# EAGLE design RFMxx-LPC812 (EAGLE 7.1.0)
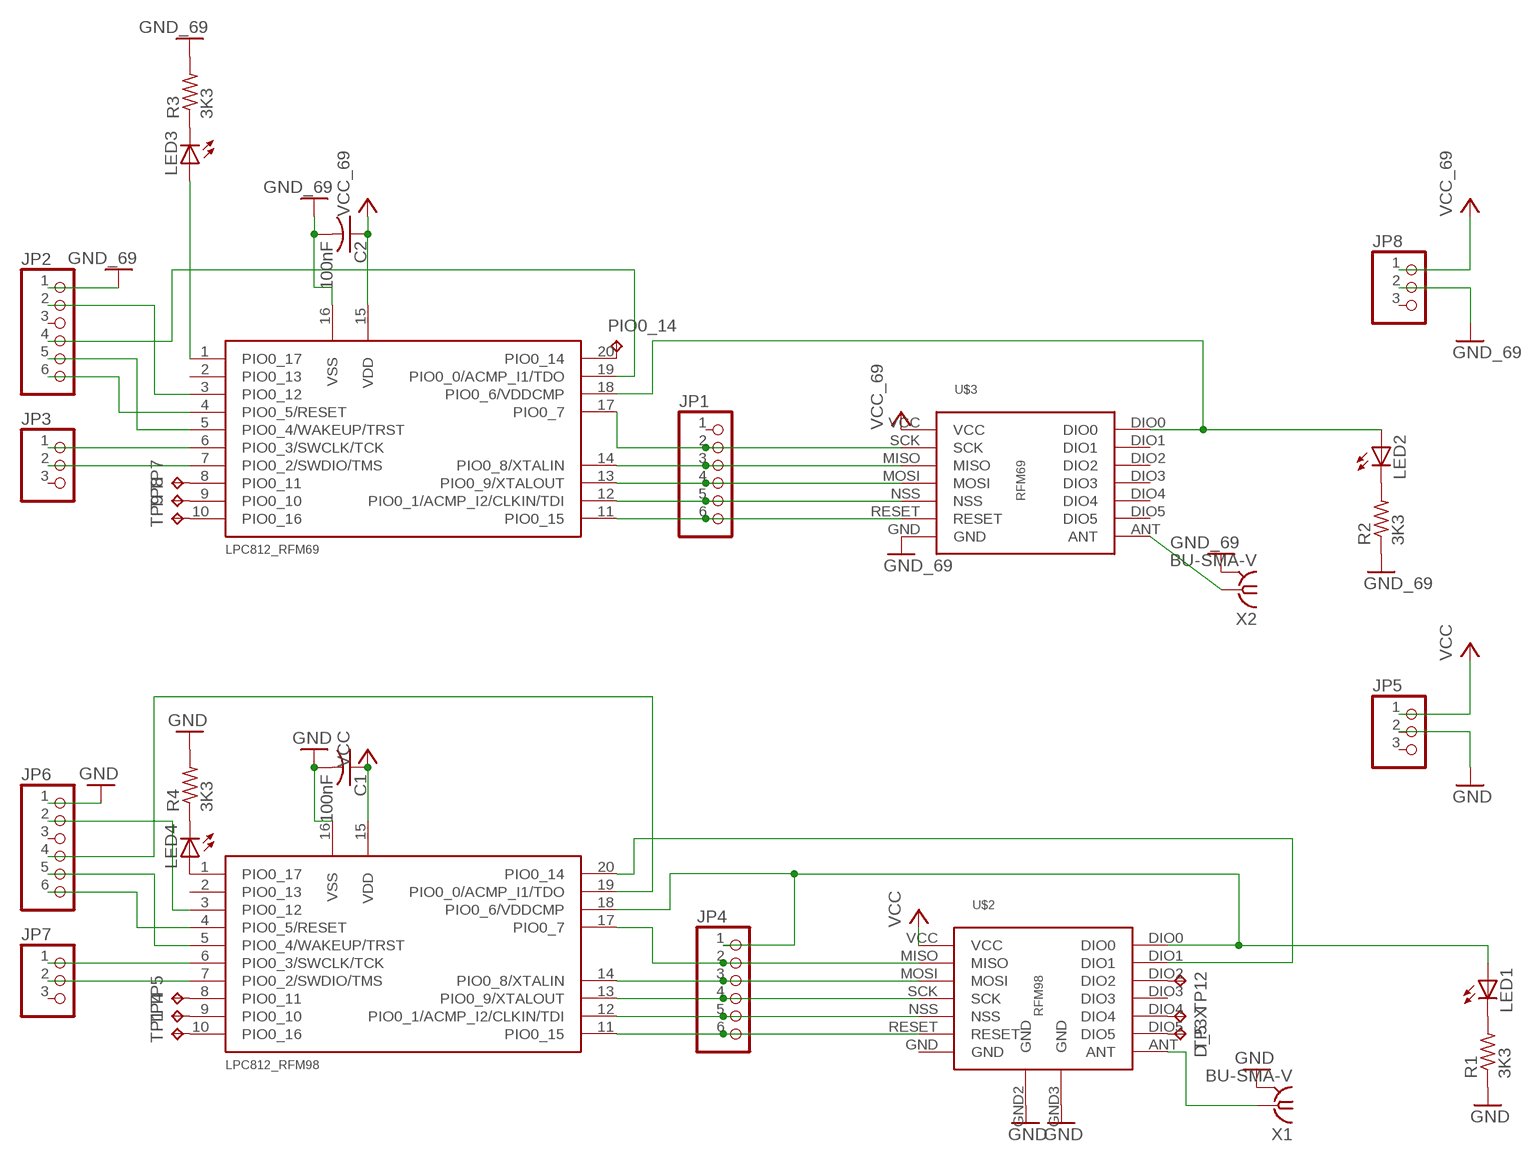
[diagram p0: schematic, sheet 1]

## Parts
C1  100nF  C-USC0805  [C0805]
C2  100nF  C-USC0805  [C0805]
D_5  TPB1,27  [B1,27]
JP1  PINHD-1X6  [1X06]
JP2  PINHD-1X6  [1X06]
JP3  PINHD-1X3  [1X03]
JP4  PINHD-1X6  [1X06]
JP5  PINHD-1X3  [1X03]
JP6  PINHD-1X6  [1X06]
JP7  PINHD-1X3  [1X03]
JP8  PINHD-1X3  [1X03]
LED1  LEDCHIP-LED0805  [CHIP-LED0805]
LED2  LEDCHIP-LED0805  [CHIP-LED0805]
LED3  LEDCHIP-LED0805  [CHIP-LED0805]
LED4  LEDCHIP-LED0805  [CHIP-LED0805]
LPC812_RFM69  LPC812M101JD20  [SOIC20]
LPC812_RFM98  LPC812M101JD20  [SOIC20]
PIO0_14  TPB1,27  [B1,27]
R1  3K3  R-US_R0805  [R0805]
R2  3K3  R-US_R0805  [R0805]
R3  3K3  R-US_R0805  [R0805]
R4  3K3  R-US_R0805  [R0805]
TP1  TPB1,27  [B1,27]
TP3X  TPB1,27  [B1,27]
TP4  TPB1,27  [B1,27]
TP5  TPB1,27  [B1,27]
TP7  TPB1,27  [B1,27]
TP8  TPB1,27  [B1,27]
TP9  TPB1,27  [B1,27]
TP12  TPB1,27  [B1,27]
U$2  RFM98W  [RFM98_PADS]
U$3  RFM69HW  [RFM69_PADS]
X1  BU-SMA-V  [BU-SMA-V]
X2  BU-SMA-V  [BU-SMA-V]

## Nets
GND: C1.2 C2.2 JP2.1 JP5.2 JP6.1 JP8.2 LPC812_RFM69.16(VSS) LPC812_RFM98.16(VSS) R1.1 R2.1 R3.2 R4.2 U$2.GND2(GND) U$2.GND3(GND) U$3.GND X1.2 X1.3 X1.4 X1.5 X2.2 X2.3 X2.4 X2.5 ; supply symbol labelled GND_69
N$1: U$3.ANT X2.1
N$2: JP2.5 LPC812_RFM69.5(PIO0_4/WAKEUP/TRST)
N$3: JP3.1 LPC812_RFM69.6(PIO0_3/SWCLK/TCK)
N$4: JP2.2 LPC812_RFM69.3(PIO0_12)
N$5: JP2.6 LPC812_RFM69.4(PIO0_5/RESET)
N$6: U$2.ANT X1.1
N$8: JP4.5 LPC812_RFM98.12(PIO0_1/ACMP_I2/CLKIN/TDI) U$2.NSS
N$9: JP4.3 LPC812_RFM98.14(PIO0_8/XTALIN) U$2.MOSI
N$10: JP4.4 LPC812_RFM98.13(PIO0_9/XTALOUT) U$2.SCK
N$11: JP4.2 LPC812_RFM98.17(PIO0_7) U$2.MISO
N$12: JP4.6 LPC812_RFM98.11(PIO0_15) U$2.RESET
N$13: JP1.6 LPC812_RFM69.11(PIO0_15) U$3.RESET
N$14: JP1.5 LPC812_RFM69.12(PIO0_1/ACMP_I2/CLKIN/TDI) U$3.NSS
N$15: JP1.4 LPC812_RFM69.13(PIO0_9/XTALOUT) U$3.MOSI
N$16: JP1.3 LPC812_RFM69.14(PIO0_8/XTALIN) U$3.MISO
N$17: JP6.6 LPC812_RFM98.4(PIO0_5/RESET)
N$18: JP6.5 LPC812_RFM98.5(PIO0_4/WAKEUP/TRST)
N$19: JP1.2 LPC812_RFM69.17(PIO0_7) U$3.SCK
N$20: JP6.4 LPC812_RFM98.19(PIO0_0/ACMP_I1/TDO)
N$21: JP6.2 LPC812_RFM98.3(PIO0_12)
N$22: JP4.1 LED1.A LPC812_RFM98.18(PIO0_6/VDDCMP) U$2.DIO0
N$23: JP3.2 LPC812_RFM69.7(PIO0_2/SWDIO/TMS)
N$24: LED2.A LPC812_RFM69.18(PIO0_6/VDDCMP) U$3.DIO0
N$25: LPC812_RFM98.10(PIO0_16) TP1.TP
N$26: LED4.A LPC812_RFM98.1(PIO0_17)
N$27: LPC812_RFM98.20(PIO0_14) U$2.DIO1
N$28: JP7.1 LPC812_RFM98.6(PIO0_3/SWCLK/TCK)
N$29: JP7.2 LPC812_RFM98.7(PIO0_2/SWDIO/TMS)
N$31: TP3X.TP U$2.DIO4
N$32: LPC812_RFM98.9(PIO0_10) TP4.TP
N$33: LPC812_RFM98.8(PIO0_11) TP5.TP
N$34: D_5.TP U$2.DIO5
N$35: JP2.4 LPC812_RFM69.19(PIO0_0/ACMP_I1/TDO)
N$36: LED3.A LPC812_RFM69.1(PIO0_17)
N$37: LED1.C R1.2
N$38: LED2.C R2.2
N$39: LED3.C R3.1
N$41: LPC812_RFM69.8(PIO0_11) TP7.TP
N$42: LED4.C R4.1
N$43: LPC812_RFM69.9(PIO0_10) TP8.TP
N$44: LPC812_RFM69.10(PIO0_16) TP9.TP
N$46: LPC812_RFM69.20(PIO0_14) PIO0_14.TP
N$52: TP12.TP U$2.DIO2
VCC: C1.1 C2.1 JP5.1 JP8.1 LPC812_RFM69.15(VDD) LPC812_RFM98.15(VDD) U$2.VCC U$3.VCC ; supply symbol labelled VCC_69
Unconnected: JP1.1 JP2.3 JP3.3 JP5.3 JP6.3 JP7.3 JP8.3 LPC812_RFM69.2(PIO0_13) LPC812_RFM98.2(PIO0_13) U$2.DIO3 U$2.GND U$3.DIO1 U$3.DIO2 U$3.DIO3 U$3.DIO4 U$3.DIO5

## Library data of the parts
C1 C2 = adafruit:C-US: CAPACITOR, American symbol
D_5 PIO0_14 TP1 TP3X TP4 TP5 TP7-TP9 TP12 = testpad:TP: Test pad
JP1 JP2 JP4 JP6 = adafruit:PINHD-1X6: PIN HEADER
JP3 JP5 JP7 JP8 = adafruit:PINHD-1X3: PIN HEADER
LED1-LED4 = adafruit:LED: LED OSRAM: - CHIPLED LG R971, LG N971, LY N971, LG Q971, LY Q971, LO R971, LY R971 LH N974, LH R974 LS Q976, LO Q976, LY Q976 LO Q996 - Hyper CHIPLED LW Q18S LB Q993, LB Q99A, LB R99A - SideLED LS A670, LO A670, LY A670, LG A670, LP A670 LB A673, LV A673, LT A673, LW A673 LH A674 LY A675 LS A676, LA A676, LO A676, LY A676, LW A676 LS A679, LY A679, LG A679 - Hyper Micro SIDELED® LS Y876, LA Y876, LO Y876, LY Y876 LT Y87S - SmartLED LW L88C, LW L88S LB L89C, LB L89S, LG L890 LS L89K, LO L89K, LY L89K LS L896, LA L896, LO L896, LY L896 - TOPLED LS T670, LO T670, LY T670, LG T670, LP T670 LSG T670, LSP T670, LSY T670, LOP T670, LYG T670 LG T671, LOG T671, LSG T671 LB T673, LV T673, LT T673, LW T673 LH T674 LS T676, LA T676, LO T676, LY T676, LB T676, LH T676, LSB T676, LW T676 LB T67C, LV T67C, LT T67C, LS T67K, LO T67K, LY T67K, LW E67C LS E67B, LA E67B, LO E67B, LY E67B, LB E67C, LV E67C, LT E67C LW T67C LS T679, LY T679, LG T679 LS T770, LO T770, LY T770, LG T770, LP T770 LB T773, LV T773, LT T773, LW T773 LH T774 LS E675, LA E675, LY E675, LS T675 LS T776, LA T776, LO T776, LY T776, LB T776 LHGB T686 LT T68C, LB T68C - Hyper Mini TOPLED® LB M676 - Mini TOPLED Santana® LG M470 LS M47K, LO M47K, LY M47K Source: http://www.osram.convergy.de/
LPC812_RFM69 LPC812_RFM98 = LPC812:LPC812M101JD20
R1-R4 = resistor:R-US_: RESISTOR, American symbol
U$2 = hoperf-rfmxx:RFM98W
U$3 = hoperf-rfmxx:RFM69HW
X1 X2 = con-coax:BU-SMA-V: FEMALE SMA CONNECTOR Radiall distributor RS 112-3794; OC_FARNELL: unknown; OC_NEWARK: unknown

## Board
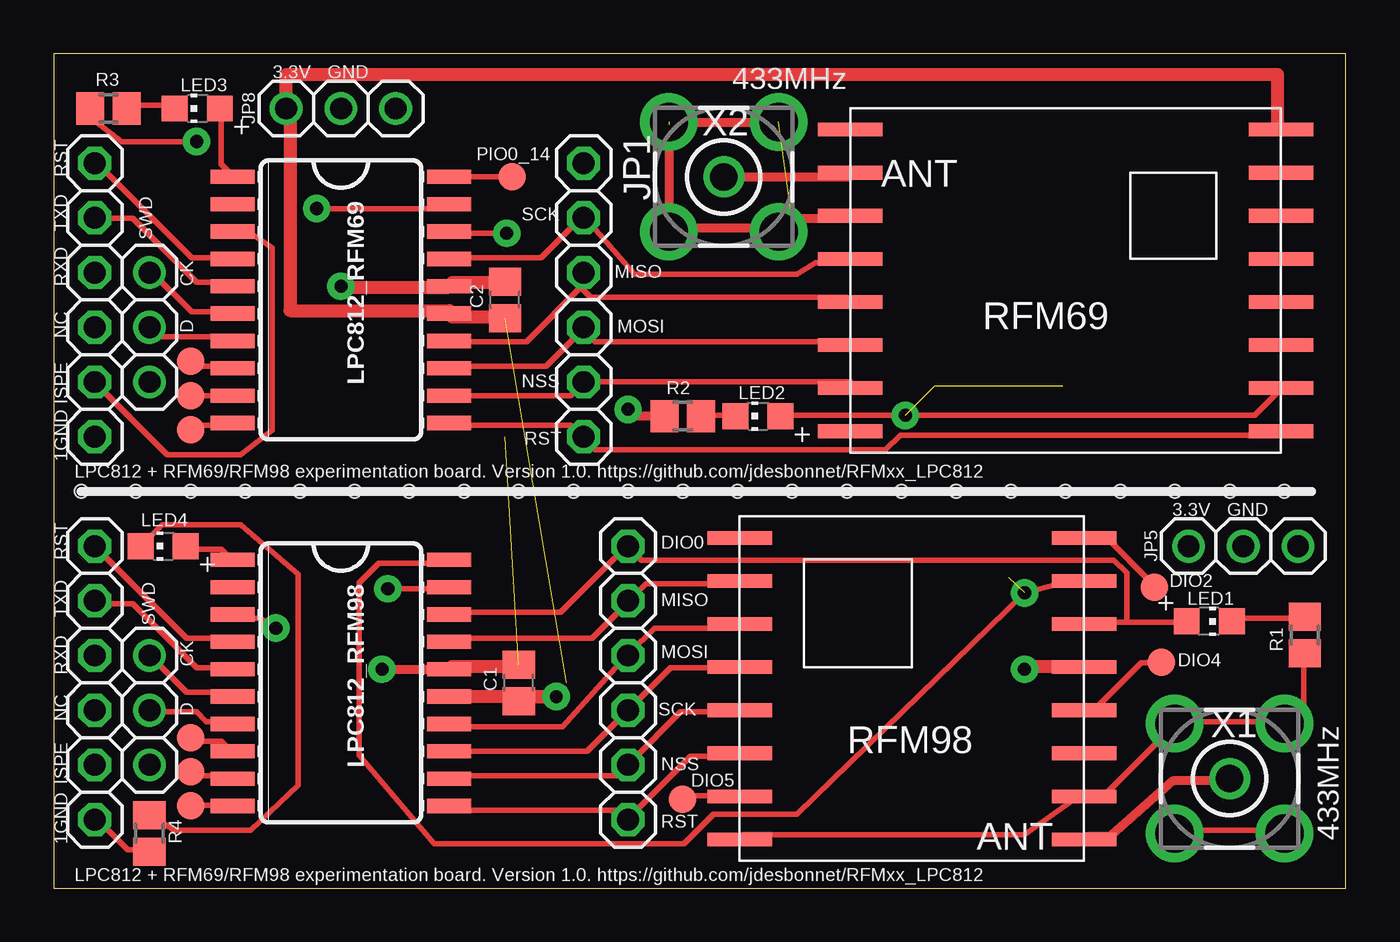
[diagram p1: board, top side]
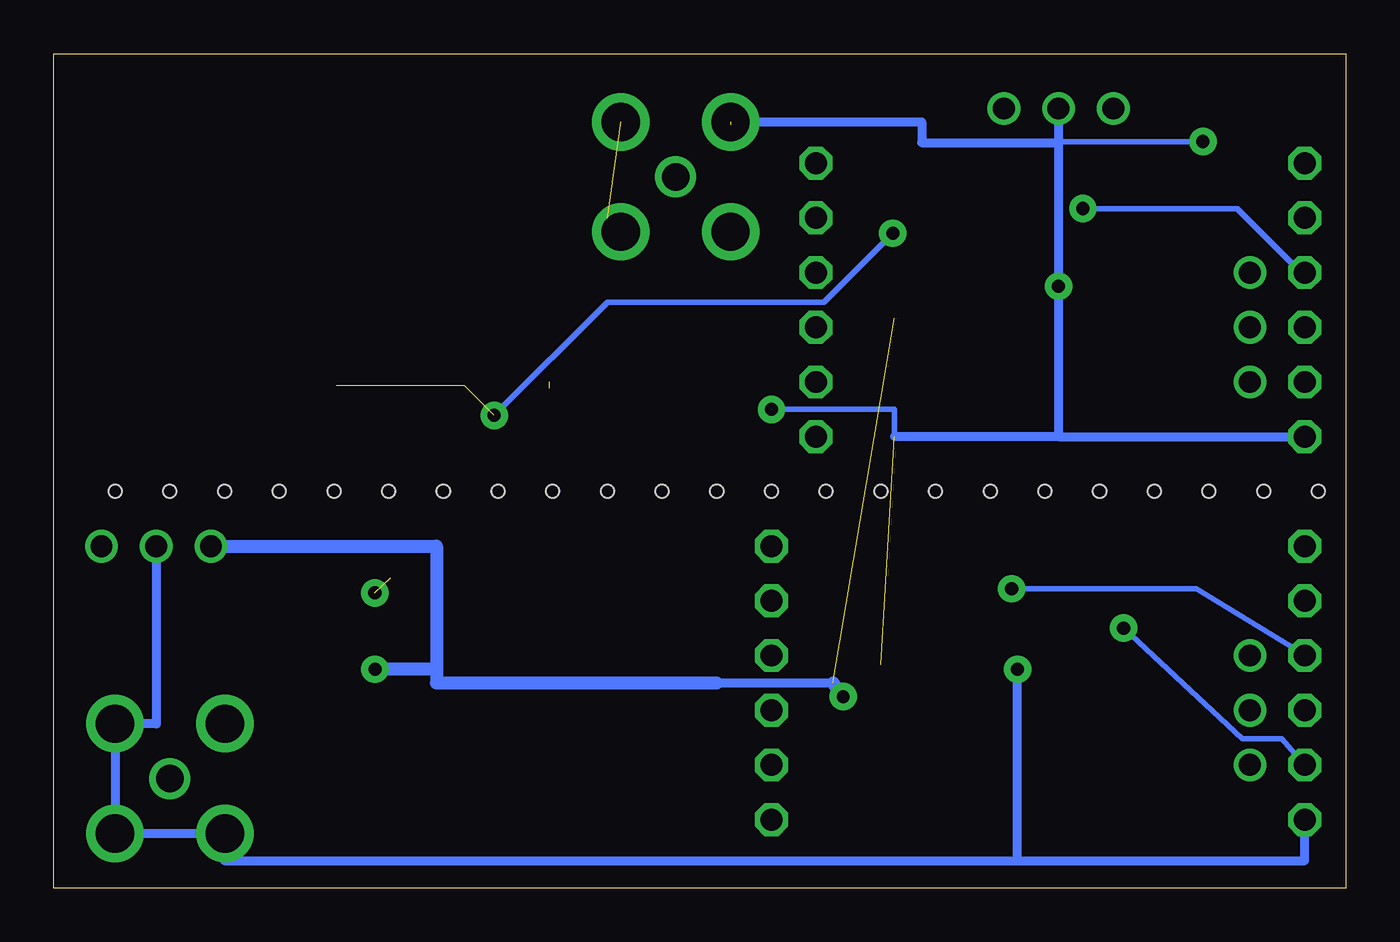
[diagram p2: board, bottom side, seen from below]

Size 60 x 38.73 mm. Coordinates in mm from the lower left corner, seen from the top.
Outline: 0,0 60,0 60,38.73 0,38.73 0,0
Copper layers (1*16): Top 0.07mm / dielectric 1.55mm / Bottom 0.07mm
Design rules "eC_2Layer_PClass4_BaseCopperO70": minimum track width 0.2mm, minimum drill 0.35mm, track to track 0.25mm, track to pad 0.25mm, pad to pad 0.25mm, via to via 0.25mm, smd to smd 0mil, copper to edge 0.25mm, drill to drill 0.35mm, minimum pad ring 0.2mm, minimum via ring 0.15mm, stop-mask expansion 0mil, vias tented up to drill 0.45mm, thermal gap 0.2mm
Holes 0.6 mm at 6.35,18.41 8.89,18.41 13.97,18.41 16.51,18.41 19.05,18.41 21.59,18.41 24.13,18.41 39.37,18.41 41.91,18.41 44.45,18.41 46.99,18.41 3.81,18.41 1.27,18.41 31.75,18.41 34.29,18.41 36.83,18.41 57.15,18.41 11.43,18.41 26.67,18.41 29.21,18.41 49.53,18.41 52.07,18.41 54.61,18.41

### Footprints (pad centres in the part's own frame; a part is rotated, then mirrored left to right if it is on the bottom)
C0805 = smd 1.3 x 1.5: 1 -0.85,0; 2 0.85,0
B1,27 = smd 1.27 x 1.27: TP 0,0
1X06 = drill 1.016 octagon: 1 -6.35,0; 2 -3.81,0; 3 -1.27,0; 4 1.27,0; 5 3.81,0; 6 6.35,0
1X03 = drill 1.016: 1 -2.54,0; 2 0,0; 3 2.54,0
CHIP-LED0805 = smd 1.2 x 1.2: A 0,-1.05; C 0,1.05
SOIC20 = smd 0.66 x 2.032: 1 -6.985,-5.029; 2 -5.715,-5.029; 3 -4.445,-5.029; 4 -3.175,-5.029; 5 -1.905,-5.029; 6 -0.635,-5.029; 7 0.635,-5.029; 8 1.905,-5.029; 9 3.175,-5.029; 10 4.445,-5.029; 11 4.445,5.029; 12 3.175,5.029; 13 1.905,5.029; 14 0.635,5.029; 15 -0.635,5.029; 16 -1.905,5.029; 17 -3.175,5.029; 18 -4.445,5.029; 19 -5.715,5.029; 20 -6.985,5.029
R0805 = smd 1.3 x 1.5: 1 -0.85,0; 2 0.85,0
RFM98_PADS = smd 3 x 0.635: ANT 8,-6; DIO0 8,4; DIO1 8,6; DIO2 8,8; DIO3 8,-2; DIO4 8,0; DIO5 -8,-4; GND -8,8; GND2 8,-4; GND3 -8,-6; MISO -8,6; MOSI -8,4; NSS -8,0; RESET -8,-2; SCK -8,2; VCC 8,2
RFM69_PADS = smd 3 x 0.635: ANT 10,-4; DIO0 -10,6; DIO1 -10,4; DIO2 -10,2; DIO3 -10,0; DIO4 -10,-2; DIO5 -10,-4; GND 10,-2; MISO 10,2; MOSI 10,4; NC 10,8; NSS 10,6; P$9 10,-6; RESET -10,8; SCK 10,0; VCC -10,-6
BU-SMA-V = drill 1.27: 1 0,0 | drill 1.778: 2 -2.55,2.55; 3 2.55,2.55; 4 2.55,-2.55; 5 -2.55,-2.55

### Placement (x,y rotation side)
C1  21.59,9.53 90 top
C2  20.95,27.3 90 top
D_5  29.21,4.13 0 top
JP1  24.61,27.3 270 top
JP2  1.91,27.3 90 top
JP3  4.45,26.04 270 top
JP4  26.67,9.53 270 top
JP5  55.24,15.88 0 top
JP6  1.91,9.53 90 top
JP7  4.45,8.26 270 top
JP8  13.34,36.2 0 top
LED1  53.66,12.38 270 top
LED2  32.7,21.91 90 top
LED3  6.67,36.2 90 top
LED4  5.08,15.88 90 top
LPC812_RFM69  13.34,26.04 270 top
LPC812_RFM98  13.34,8.26 270 top
PIO0_14  21.27,33.02 0 top
R1  58.1,11.75 90 top
R2  29.21,21.91 0 top
R3  2.54,36.2 180 top
R4  4.45,2.54 270 top
TP1  6.35,3.81 0 top
TP3X  51.44,10.48 0 top
TP4  6.35,5.4 0 top
TP5  6.35,6.99 0 top
TP7  6.35,24.45 0 top
TP8  6.35,22.86 0 top
TP9  6.35,21.27 0 top
TP12  51.12,13.97 0 top
U$2  39.85,8.26 0 top
U$3  46.99,29.21 180 top
X1  54.61,5.08 0 top
X2  31.12,33.02 0 top

### Tracks (layer width: path | path; a pad name or v marks a point on that pad's centre or on a via)
GND  (via drill 0.6 pad 1.27, 0.61 pad 1.27)  (4 unrouted)
  Top 0.254: 31.85,2.46 U$2.GND3 32,2.46 45.09,2.46 47.32,4.06 47.78,4.06 U$2.GND2 47.85,4.29 48.77,4.29 51.97,7.49 X1.2 52.12,7.72 57.15,7.72 X1.3 57.38,7.72 58.06,8.41 58.06,10.69 R1.1 | X1.5 52.12,2.69 57.15,2.69 X1.4 | 36.8,31.09 U$3.GND | 33.83,30.63 X2.4 33.6,30.63 | 28.57,30.63 X2.5 | 13.49,27.89 v13.34,27.94 | 20.8,28.12 C2.2 | 18.52,28.12 LPC812_RFM69.16 18.29,27.89 | v6.63,34.66 3.15,34.66 1.83,35.66 1.83,36.12 R3.2 | JP6.1 2.06,3.15 3.43,1.78 4.34,1.78 4.34,1.83 R4.2 | 21.49,10.29 C1.2 | 18.52,10.29 LPC812_RFM98.16 18.29,10.06 18.29,10.16
  Top 0.406: 28.57,35.43 28.57,30.63 33.6,30.63 | 36.8,31.09 34.29,31.09 33.83,30.63 | v15.24,10.16 18.29,10.16 LPC812_RFM98.16 18.41,10.16 | R2.1 26.67,21.91 26.67,22.23
  Top 0.61: 13.49,27.89 18.29,27.89 | 18.52,28.12 20.8,28.12 | 18.52,10.29 21.49,10.29
  Bottom 0.254: 1.83,20.8 JP2.1 | 13.34,34.66 v6.63,34.66 | 20.95,20.95 20.95,22.23 26.67,22.23 | 33.83,30.63 X2.4 | 52.12,2.54 52.12,2.52 X1.5 | X1.3 57.15,7.77 X1.3 | 15.32,10.29 v15.24,10.16
  Bottom 0.406: JP8.2 13.34,34.66 13.34,34.61 | 13.34,34.61 v13.34,27.94 13.34,20.95 | 13.34,20.95 JP2.1 | 13.34,20.95 20.95,20.95 | JP5.2 55.24,7.62 X1.3 X1.4 52.12,2.54 X1.5 52.07,1.27 15.24,1.27 | 15.24,1.27 1.91,1.27 JP6.1 1.91,2.54 | 15.24,1.27 v15.24,10.16 | 28.57,34.98 X2.2 19.68,35.57 19.68,34.61 13.34,34.61
N$1
  Top 0.254: 36.96,33.02 U$3.ANT
  Top 0.406: X2.1 36.96,33.02
N$2
  Top 0.254: LPC812_RFM69.5 8.23,28.12 6.63,28.12 3.66,31.09 2.06,31.09 JP2.5
N$3
  Top 0.254: LPC812_RFM69.6 8.23,26.75 6.4,26.75 4.57,28.57 JP3.1
N$4
  Top 0.254: LPC812_RFM69.3 8.46,30.4 9.14,30.4 10.15,29.72 10.15,21.26 8.69,20.12 5.26,20.12 2.06,23.32 JP2.2
N$5
  Top 0.254: LPC812_RFM69.4 8.23,29.26 6.4,29.26 2.06,33.6 JP2.6
N$6
  Top 0.254: 49.14,2.46 47.85,2.46 U$2.ANT | 54.48,4.98 X1.1
  Top 0.406: 49.14,2.46 51.97,4.98 54.48,4.98
N$8
  Top 0.254: LPC812_RFM98.12 18.36,5.21 26.14,5.21 26.59,5.66 JP4.5 26.82,5.89 29.11,8.18 31.62,8.18 U$2.NSS
N$9
  Top 0.254: U$2.MOSI 31.62,12.06 27.89,12.06 26.75,10.92 JP4.3 | 26.82,10.92 JP4.3 | LPC812_RFM98.14 18.52,7.49 23.64,7.49 26.52,10.69 JP4.3
N$10
  Top 0.254: LPC812_RFM98.13 24.77,6.35 JP4.4 28.65,10.24 31.62,10.24 U$2.SCK
N$11
  Top 0.254: LPC812_RFM98.17 18.36,11.61 24.99,11.61 26.59,13.21 JP4.2 26.82,13.44 27.51,14.12 31.62,14.12 U$2.MISO
N$12
  Top 0.254: LPC812_RFM98.11 18.36,3.61 26.36,3.61 26.59,3.38 JP4.6 26.82,3.38 29.57,6.12 31.62,6.12 U$2.RESET
N$13
  Top 0.254: LPC812_RFM69.11 18.52,21.49 24,21.49 24.46,21.03 JP1.6 24.69,20.8 25.15,20.34 38.63,20.34 39.32,21.03 56.92,21.03 U$3.RESET
N$14  (1 unrouted)
  Top 0.254: LPC812_RFM69.12 24,22.86 24.23,23.09 | 24.23,23.09 24.46,23.32 JP1.5 | 36.8,23.09 U$3.NSS | 24.23,23.09 JP1.5 | JP1.5 36.99,23.5
N$15
  Top 0.254: LPC812_RFM69.13 18.52,24.23 22.86,24.23 24.46,25.83 JP1.4 24.69,25.83 25.15,25.38 36.8,25.38 U$3.MOSI
N$16
  Top 0.254: 24.46,27.89 21.95,25.38 18.52,25.38 LPC812_RFM69.14 | 24.46,27.89 24.46,28.57 JP1.3 24.46,27.89 | 24.46,27.89 24.92,27.43 36.8,27.43 U$3.MISO
N$17
  Top 0.254: JP6.6 6.17,11.61 8.23,11.61 LPC812_RFM98.4
N$18
  Top 0.254: LPC812_RFM98.5 8.23,10.24 6.63,10.24 3.66,13.21 2.06,13.21 JP6.5
N$19
  Top 0.254: LPC812_RFM69.17 18.52,29.26 22.63,29.26 24.46,31.09 JP1.2 24.69,31.09 26.98,28.49 34.52,28.49 35.38,29.03 36.8,29.03 U$3.SCK
N$20  (via drill 0.61 pad 1.27)
  Top 0.254: v15.52,13.89 18.36,13.89 LPC812_RFM98.19
  Bottom 0.254: v15.52,13.89 6.93,13.89 2.06,10.92 JP6.4
N$21  (via drill 0.61 pad 1.27)
  Top 0.254: v10.31,12.06 9.6,12.52 8.46,12.52 LPC812_RFM98.3
  Bottom 0.254: v10.31,12.06 4.8,6.93 2.97,6.93 2.06,5.89 JP6.2
N$22
  Top 0.254: 49.84,12.34 48.01,12.34 U$2.DIO0 | 49.84,12.34 52.58,12.34 LED1.A | 49.84,12.34 49.84,14.63 49.24,15.23 27.29,15.23 26.75,15.77 JP4.1 26.52,15.77 23.55,12.8 18.52,12.8 LPC812_RFM98.18
N$23
  Top 0.254: LPC812_RFM69.7 8.23,25.6 4.8,25.6 4.57,25.83 JP3.2
N$24  (via drill 0.61 pad 1.27)  (2 unrouted)
  Top 0.254: LED2.A 33.83,21.95 v39.55,21.95 55.78,21.95 56.92,23.09 U$3.DIO0 | v21.03,30.4 18.52,30.4 LPC812_RFM69.18
  Bottom 0.254: v21.03,30.4 24.23,27.2 34.29,27.2 v39.55,21.95
N$25
  Top 0.254: TP1.TP 6.4,3.83 8.23,3.83 LPC812_RFM98.10
N$26
  Top 0.254: LED4.A 6.17,15.72 7.77,15.72 8.23,15.27 LPC812_RFM98.1
N$27  (via drill 0.61 pad 1.27)  (1 unrouted)
  Top 0.254: U$2.DIO1 47.78,14.4 v45.09,13.7 34.52,3.43 30.63,3.43 29.26,2.06 17.65,2.06 14.17,6.17 14.17,14.17 15.09,15.09 18.29,15.09 LPC812_RFM98.20
N$28
  Top 0.254: LPC812_RFM98.6 8.23,9.09 6.17,9.09 4.57,10.69 JP7.1
N$29
  Top 0.254: LPC812_RFM98.7 8.23,7.72 7.09,7.72 6.63,8.18 4.57,8.18 JP7.2
N$31
  Top 0.254: TP3X.TP 51.66,10.46 50.52,10.46 48.46,8.41 48.01,8.41 U$2.DIO4
N$32
  Top 0.254: TP4.TP 6.4,5.21 8.23,5.21 LPC812_RFM98.9
N$33
  Top 0.254: TP5.TP 6.4,6.81 7.77,6.81 8.23,6.35 LPC812_RFM98.8
N$34
  Top 0.254: D_5.TP 29.26,4.29 31.77,4.29 U$2.DIO5
N$35  (via drill 0.61 pad 1.27)
  Top 0.254: v12.21,31.55 18.29,31.55 LPC812_RFM69.19
  Bottom 0.254: v12.21,31.55 5.03,31.55 2.06,28.57 JP2.4
N$36
  Top 0.254: LED3.A 7.77,36.12 7.77,33.6 8.23,33.15 LPC812_RFM69.1
N$37
  Top 0.254: LED1.C 54.86,12.52 58.06,12.52 R1.2
N$38
  Top 0.254: LED2.C 31.55,21.95 29.95,21.95 R2.2
N$39
  Top 0.254: LED3.C 5.49,36.35 3.43,36.35 R3.1
N$40  (via drill 0.6 pad 1.27)
  other vias: 26.67,22.23
N$41
  Top 0.254: TP7.TP 6.4,24.23 8.23,24.23 LPC812_RFM69.8
N$42
  Top 0.254: LED4.C 4.12,15.95 5.03,16.87 8.69,16.87 11.35,14.58 11.35,4.78 9.14,2.69 5.58,2.69 4.57,3.38 R4.1
N$43
  Top 0.254: LPC812_RFM69.9 TP8.TP
N$44
  Top 0.254: TP9.TP 6.4,21.49 8.23,21.49 LPC812_RFM69.10
N$45
  Top 0.406: 28.57,35.56 33.66,35.56
N$46
  Top 0.254: PIO0_14.TP LPC812_RFM69.20
N$52
  Top 0.254: TP12.TP 50.98,14.17 48.92,16.23 48.01,16.23 U$2.DIO2
VCC  (via drill 0.6 pad 1.27)  (1 unrouted)
  Top 0.254: U$3.VCC 56.92,35.2 56.83,35.24 | 52.58,15.95 JP5.1 52.58,16 | 20.8,26.52 C2.1 | 18.52,26.52 LPC812_RFM69.15 18.29,26.75 16.92,26.75 | 10.97,36.12 JP8.1 | 48.92,10.29 48.01,10.29 U$2.VCC 47.78,10.29 | 45.26,10.29 v45.09,10.16 | C1.1 21.72,8.69 23.32,8.69 v23.34,8.89 23.32,8.91 | 18.52,8.91 LPC812_RFM98.15
  Top 0.406: 18.36,26.81 LPC812_RFM69.15
  Top 0.61: JP8.1 10.79,37.78 56.83,37.78 56.83,35.24 | 18.52,26.52 20.8,26.52 | 10.97,36.12 10.97,26.81 18.36,26.81 | 45.26,10.29 47.78,10.29 | 18.52,8.91 23.32,8.91
  Bottom 0.406: 29.21,9.53 23.81,9.53
  Bottom 0.61: JP5.1 42.23,15.88 42.23,10.16 | 42.23,10.16 42.23,9.53 29.21,9.53 | 23.81,9.53 v23.34,8.89 | 42.23,10.16 v45.09,10.16

### Text on the board
tPlace: 3.3V | GND | 433MHz | RST | SCK | TXD | SWD | RXD | CK | MISO | NC | D | MOSI | NSS | ISPE | RST | 1GND | 3.3V | GND | DIO0 | RST | DIO2 | TXD | MISO | SWD | MOSI | RXD | CK | DIO4 | NC | D | SCK | ISPE | NSS | DIO5 | RST | 1GND | 433MHz
tNames: LPC812 + RFM69/RFM98 experimentation board. Version 1.0. https://github.com/jdesbonnet/RFMxx_LPC812 | LPC812 + RFM69/RFM98 experimentation board. Version 1.0. https://github.com/jdesbonnet/RFMxx_LPC812